# Altium schematic sheet Combinational_Logic_Functions.SchDoc
size A3
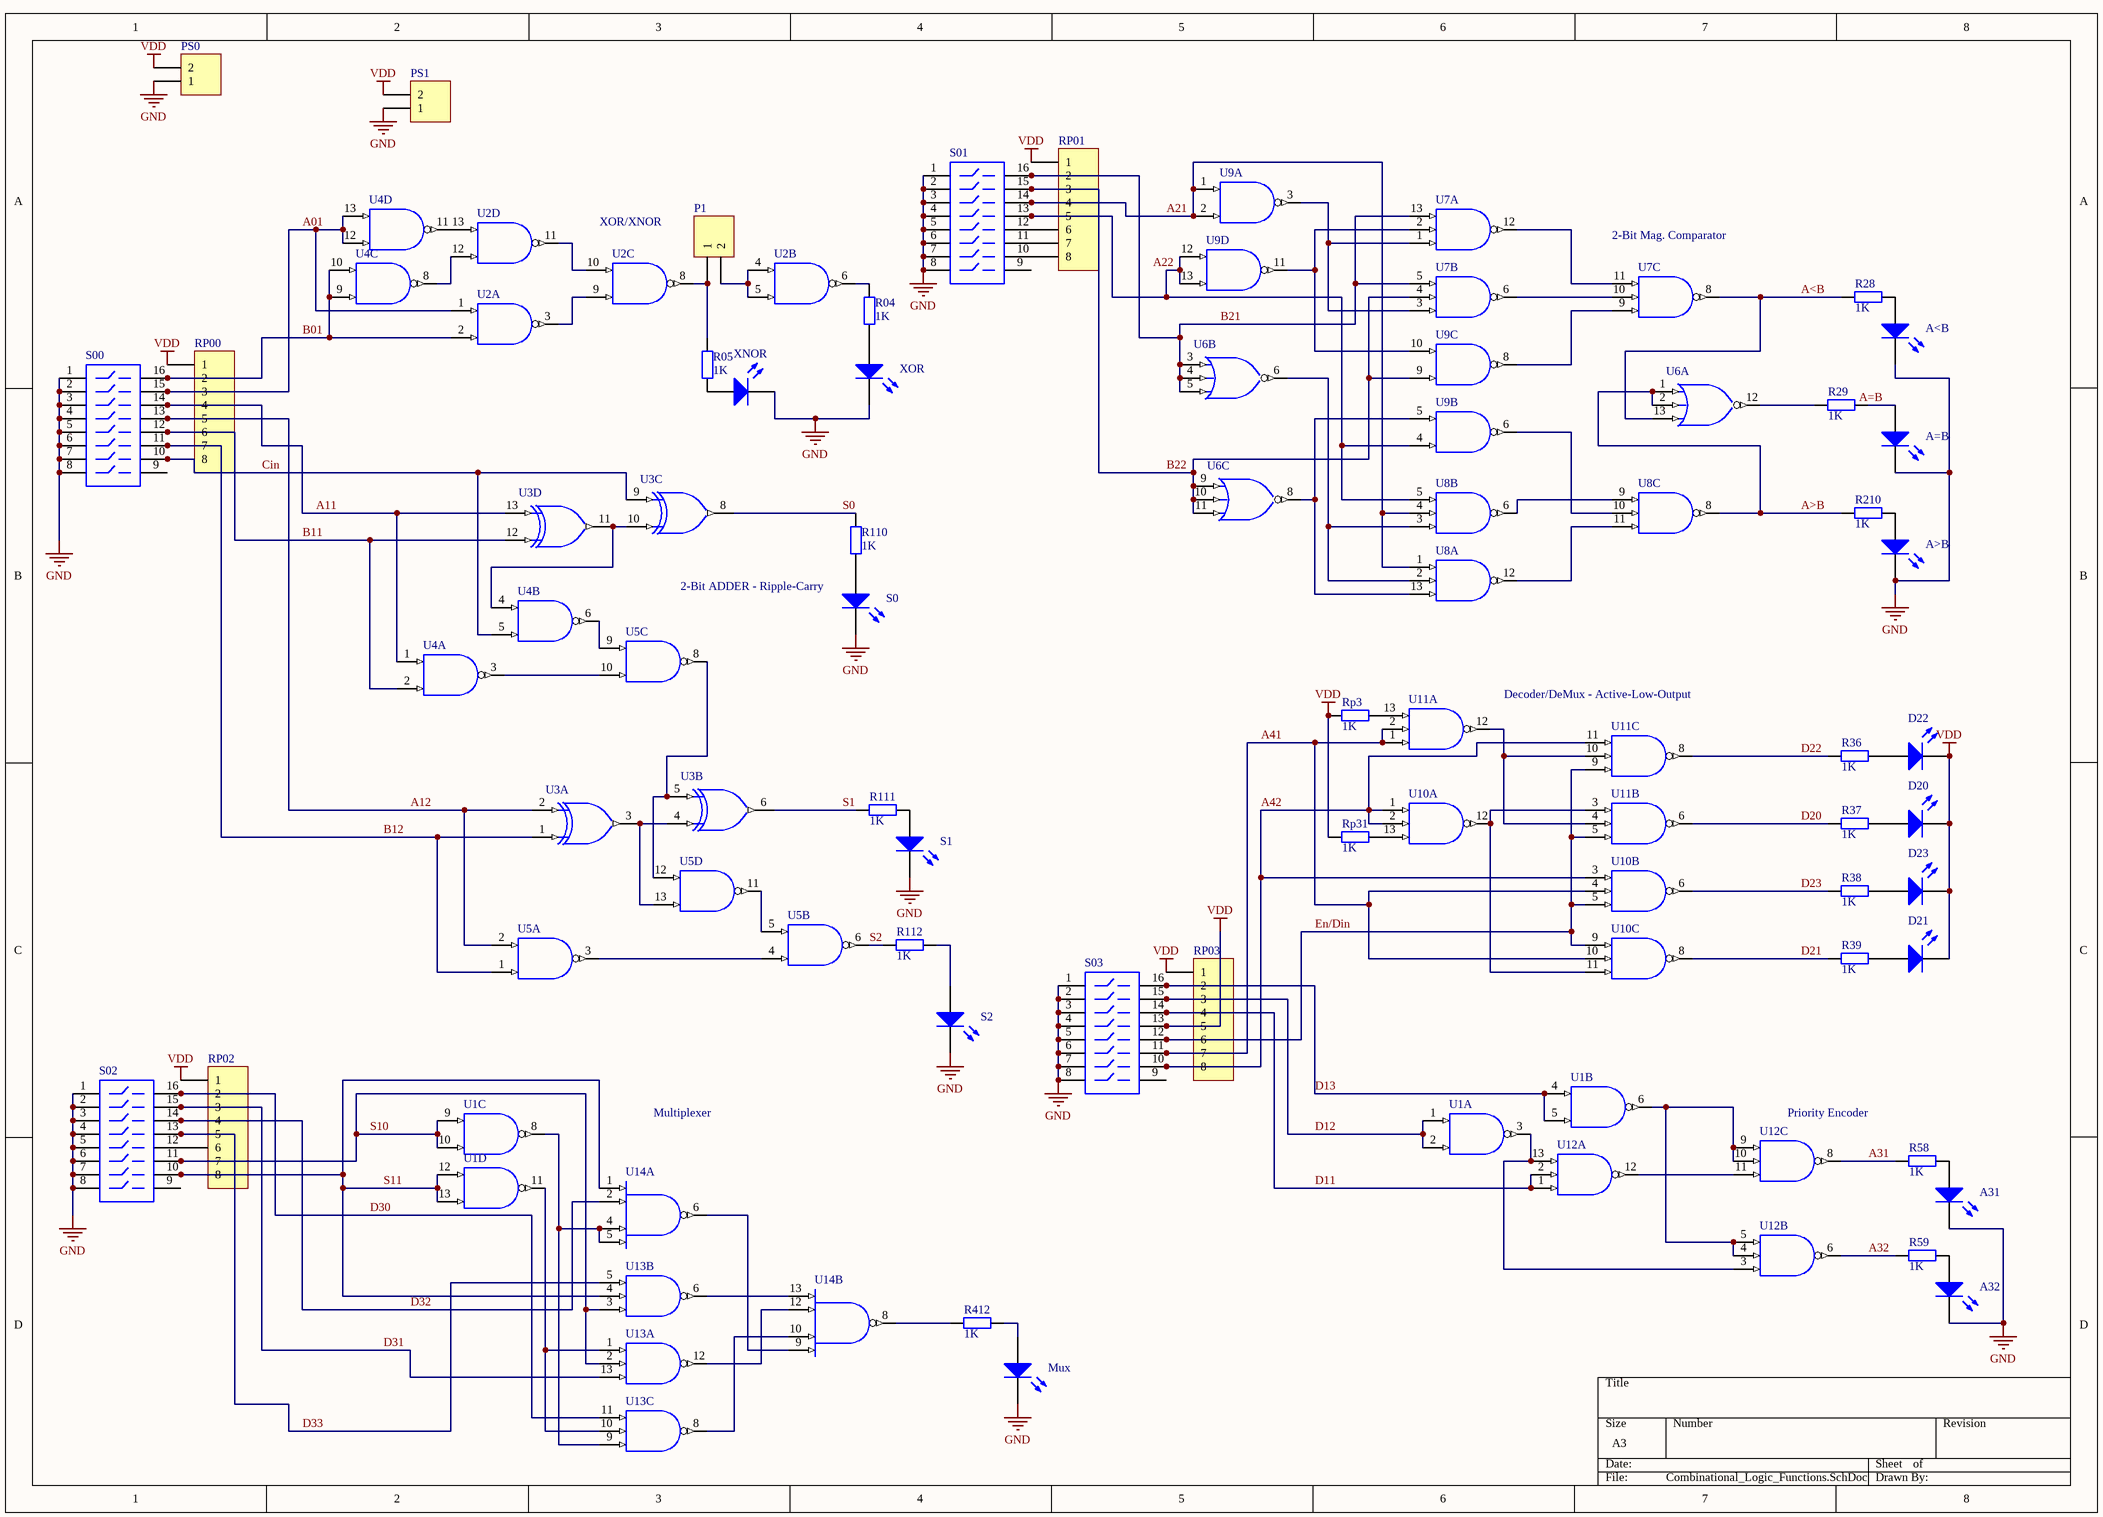
[diagram p0: Combinational_Logic_Functions.SchDoc]

## Parts
A31  LED0  [LED-0]  (value not drawn)
A32  LED0  [LED-0]  (value not drawn)
A<B  LED0  [LED-0]  (value not drawn)
A=B  LED0  [LED-0]  (value not drawn)
A>B  LED0  [LED-0]  (value not drawn)
D20  LED0  [LED-0]  (value not drawn)
D21  LED0  [LED-0]  (value not drawn)
D22  LED0  [LED-0]  (value not drawn)
D23  LED0  [LED-0]  (value not drawn)
Mux  LED0  [LED-0]  (value not drawn)
P1  Header 2  [HDR1X2]  (value not drawn)
PS0  Header 2  [HDR1X2]  (value not drawn)
PS1  Header 2  [HDR1X2]  (value not drawn)
R04  1K  [AXIAL-0.4]
R05  1K  [AXIAL-0.4]
R28  1K  [AXIAL-0.4]
R29  1K  [AXIAL-0.4]
R36  1K  [AXIAL-0.4]
R37  1K  [AXIAL-0.4]
R38  1K  [AXIAL-0.4]
R39  1K  [AXIAL-0.4]
R58  1K  [AXIAL-0.4]
R59  1K  [AXIAL-0.4]
R110  1K  [AXIAL-0.4]
R111  1K  [AXIAL-0.4]
R112  1K  [AXIAL-0.4]
R210  1K  [AXIAL-0.4]
R412  1K  [AXIAL-0.4]
RP00  Header 8  [HDR1X8]  (value not drawn)
RP01  Header 8  [HDR1X8]  (value not drawn)
RP02  Header 8  [HDR1X8]  (value not drawn)
Rp3  1K  [AXIAL-0.4]
RP03  Header 8  [HDR1X8]  (value not drawn)
Rp31  1K  [AXIAL-0.4]
S0  LED0  [LED-0]  (value not drawn)
S00  SW-DIP8  [DIP-16-KEY]  (value not drawn)
S1  LED0  [LED-0]  (value not drawn)
S01  SW-DIP8  [DIP-16-KEY]  (value not drawn)
S2  LED0  [LED-0]  (value not drawn)
S02  SW-DIP8  [DIP-16-KEY]  (value not drawn)
S03  SW-DIP8  [DIP-16-KEY]  (value not drawn)
U1  MC54HC00AJ  [632-08]  (value not drawn)  (parts A,B,C,D of 4)
U2  MC54HC00AJ  [632-08]  (value not drawn)  (parts A,B,C,D of 4)
U3  MC74HC86N  [646-06]  (value not drawn)  (parts A,B,C,D of 4)
U4  MC54HC00AJ  [632-08]  (value not drawn)  (parts A,B,C,D of 4)
U5  MC54HC00AJ  [632-08]  (value not drawn)  (parts A,B,C,D of 4)
U6  MC54HC27J  [632-08]  (value not drawn)  (parts A,B,C of 3)
U7  MC54HC10J  [632-08]  (value not drawn)  (parts A,B,C of 3)
U8  MC54HC10J  [632-08]  (value not drawn)  (parts A,B,C of 3)
U9  MC54HC00AJ  [632-08]  (value not drawn)  (parts A,B,C,D of 4)
U10  MC54HC10J  [632-08]  (value not drawn)  (parts A,B,C of 3)
U11  MC54HC10J  [632-08]  (value not drawn)  (parts A,B,C of 3)
U12  MC74HC10N  [646-06]  (value not drawn)  (parts A,B,C of 3)
U13  MC54HC10J  [632-08]  (value not drawn)  (parts A,B,C of 3)
U14  MC54HC20J  [632-08]  (value not drawn)  (parts A,B of 2)
XNOR  LED0  [LED-0]  (value not drawn)
XOR  LED0  [LED-0]  (value not drawn)

## Nets
GND: A31.2(K) A32.2(K) A<B.2(K) A=B.2(K) A>B.2(K) Mux.2(K) PS0.1 PS1.1 S00.1 S0.2(K) S00.2 S00.3 S00.4 S00.5 S00.6 S00.7 S00.8 S01.1 S1.2(K) S01.2 S01.3 S01.4 S01.5 S01.6 S01.7 S01.8 S02.1 S2.2(K) S02.2 S02.3 S02.4 S02.5 S02.6 S02.7 S02.8 S03.1 S03.2 S03.3 S03.4 S03.5 S03.6 S03.7 S03.8 U1.7(GND) U2.7(GND) U3.7(GND) U4.7(GND) U5.7(GND) U6.7(GND) U7.7(GND) U8.7(GND) U9.7(GND) U10.7(GND) U11.7(GND) U12.7(GND) U13.7(GND) U14.7(GND) XNOR.2(K) XOR.2(K)
VDD: D20.2(K) D21.2(K) D22.2(K) D23.2(K) PS0.2 PS1.2 RP00.1 RP01.1 RP02.1 Rp3.1 RP03.1 RP03.5 Rp31.1 S03.13 U1.14(VDD) U2.14(VDD) U3.14(VDD) U4.14(VDD) U5.14(VDD) U6.14(VDD) U7.14(VDD) U8.14(VDD) U9.14(VDD) U10.14(VDD) U11.14(VDD) U12.14(VDD) U13.14(VDD) U14.14(VDD)
A01: RP00.3 S00.15 U2.1(A) U4.12(A) U4.13(B)
A11: RP00.4 S00.14 U3.13(B) U4.1(A)
A12: RP00.5 S00.13 U3.2(B) U5.2(B)
A21: RP01.4 S01.14 U8.1(A) U8.4(B) U9.1(A) U9.2(B)
A31: R58.2 U12.8(Y)
A32: R59.2 U12.6(Y)
A41: RP03.7 S03.11 U10.4(B) U10.10(B) U11.1(A) U11.2(B)
A42: RP03.8 S03.10 U10.1(A) U10.2(B) U10.3(A) U11.11(C)
A<B: R28.1 U6.13(C) U7.8(Y)
A>B: R210.1 U6.1(A) U6.2(B) U8.8(Y)
B01: RP00.2 S00.16 U2.2(B) U4.9(A) U4.10(B)
B11: RP00.6 S00.12 U3.12(A) U4.2(B)
B12: RP00.7 S00.11 U3.1(A) U5.1(A)
B21: RP01.2 S01.16 U6.3(A) U6.4(B) U6.5(C) U7.5(C) U7.13(C)
B22: RP01.3 S01.15 U6.9(A) U6.10(B) U6.11(C) U7.4(B) U9.9(A)
Cin: RP00.8 S00.10 U3.9(A) U4.5(B)
D11: RP03.4 S03.14 U12.1(A) U12.2(B)
D12: RP03.3 S03.15 U1.1(A) U1.2(B)
D13: RP03.2 S03.16 U1.4(A) U1.5(B)
D20: R37.1 U11.6(Y)
D21: R39.1 U10.8(Y)
D22: R36.1 U11.8(Y)
D23: R38.1 U10.6(Y)
D30: RP02.2 S02.16 U13.11(C)
D31: RP02.3 S02.15 U13.13(C)
D32: RP02.4 S02.14 U14.2(B)
D33: RP02.5 S02.13 U13.5(C)
En/Din: RP03.6 S03.12 U10.5(C) U10.9(A) U11.5(C) U11.9(A)
S0: R110.2 U3.8(Y)
S1: R111.2 U3.6(Y)
S2: R112.2 U5.6(Y)
S10: RP02.7 S02.11 U1.9(A) U1.10(B) U13.2(B) U13.3(A)
S11: RP02.8 S02.10 U1.12(A) U1.13(B) U13.4(B) U14.1(A)
NetA31_1: A31.1(A) R58.1
NetA32_1: A32.1(A) R59.1
NetA<B_1: A<B.1(A) R28.2
NetA=B_1: A=B.1(A) R29.2
NetA>B_1: A>B.1(A) R210.2
NetD20_1: D20.1(A) R37.2
NetD21_1: D21.1(A) R39.2
NetD22_1: D22.1(A) R36.2
NetD23_1: D23.1(A) R38.2
NetMux_1: Mux.1(A) R412.1
NetP1_1: P1.1 R05.2 U2.8(Y)
NetP1_2: P1.2 U2.4(A) U2.5(B)
NetR04_1: R04.1 XOR.1(A)
NetR04_2: R04.2 U2.6(Y)
NetR05_1: R05.1 XNOR.1(A)
NetR29_1: R29.1 U6.12(Y)
NetR110_1: R110.1 S0.1(A)
NetR111_1: R111.1 S1.1(A)
NetR112_1: R112.1 S2.1(A)
NetR412_2: R412.2 U14.8(Y)
NetRP01_5: RP01.5 S01.13 U8.5(C) U9.4(A) U9.12(A) U9.13(B)
NetRP01_6: RP01.6 S01.12
NetRP01_7: RP01.7 S01.11
NetRP01_8: RP01.8 S01.10
NetRP02_6: RP02.6 S02.12
NetRp3_2: Rp3.2 U11.13(C)
NetRp31_2: Rp31.2 U10.13(C)
NetU1_3: U1.3(Y) U12.3(A) U12.13(C)
NetU1_6: U1.6(Y) U12.4(B) U12.5(C) U12.9(A) U12.10(B)
NetU1_8: U1.8(Y) U13.9(A) U14.4(C) U14.5(D)
NetU1_11: U1.11(Y) U13.1(A) U13.10(B)
NetU2_3: U2.3(Y) U2.9(A)
NetU2_10: U2.10(B) U2.11(Y)
NetU2_12: U2.12(A) U4.8(Y)
NetU2_13: U2.13(B) U4.11(Y)
NetU3_3: U3.3(Y) U3.4(A) U5.13(B)
NetU3_5: U3.5(B) U5.8(Y) U5.12(A)
NetU3_10: U3.10(B) U3.11(Y) U4.4(A)
NetU4_3: U4.3(Y) U5.10(B)
NetU4_6: U4.6(Y) U5.9(A)
NetU5_3: U5.3(Y) U5.4(A)
NetU5_5: U5.5(B) U5.11(Y)
NetU6_6: U6.6(Y) U8.2(B) U8.3(A)
NetU6_8: U6.8(Y) U8.13(C) U9.5(B)
NetU7_1: U7.1(A) U7.3(A) U9.3(Y)
NetU7_2: U7.2(B) U9.10(B) U9.11(Y)
NetU7_6: U7.6(Y) U7.10(B)
NetU7_9: U7.9(A) U9.8(Y)
NetU7_11: U7.11(C) U7.12(Y)
NetU8_6: U8.6(Y) U8.9(A)
NetU8_10: U8.10(B) U9.6(Y)
NetU8_11: U8.11(C) U8.12(Y)
NetU10_11: U10.11(C) U10.12(Y) U11.3(A)
NetU11_4: U11.4(B) U11.10(B) U11.12(Y)
NetU12_11: U12.11(C) U12.12(Y)
NetU13_6: U13.6(Y) U14.13(D)
NetU13_8: U13.8(Y) U14.10(B)
NetU13_12: U13.12(Y) U14.12(C)
NetU14_6: U14.6(Y) U14.9(A)

Not connected (* = marked no-connect by the designer): S00 9; S01 9; S02 9; S03 9

## Notes on the sheet
- (near U2) XOR/XNOR
- (near U7) 2-Bit Mag. Comparator
- (near S0) 2-Bit ADDER - Ripple-Carry
- (near U11) Decoder/DeMux - Active-Low-Output
- Multiplexer
- (near U12) Priority Encoder
- Labels drawn without touching a wire or pin: A22, A=B

## Library data of the parts
A31 A32 A<B A=B A>B D20-D23 Mux S0-S2 XNOR XOR = LED0: Typical INFRARED GaAs LED; Published: 8-Jun-2000; LatestRevisionDate: 08-Jul-2005; LatestRevisionNote: Mech Layer 1 removed.; PackageReference: LED-0; Publisher: Altium Limited; PackageDescription: LED; 2 Leads
P1 PS0 PS1 = Header 2: Header, 2-Pin; LatestRevisionDate: 17-Jul-2002; LatestRevisionNote: Re-released for DXP Platform.; Publisher: Altium Limited
R04 R05 R28 R29 R36-R39 R58 R59 R110-R112 R210 R412 Rp3 Rp31 = Res2: Resistor; Published: 8-Jun-2000; LatestRevisionDate: 17-Jul-2002; LatestRevisionNote: Re-released for DXP Platform.; PackageReference: AXIAL-0.4; Publisher: Altium Limited; PackageDescription: Axial Device, Thru-Hole; 2 Leads; 0.4 in Pin Spacing; Value: 1K
RP00 RP01 RP02 RP03 = Header 8: Header, 8-Pin; LatestRevisionDate: 17-Jul-2002; LatestRevisionNote: Re-released for DXP Platform.; Publisher: Altium Limited
S00 S01 S02 S03 = SW-DIP8: 4009 Series DIP Switch, Raised actuator; Published: 24-Mar-1999; LatestRevisionDate: 17-Dec-2003; LatestRevisionNote: PCB Footprint replaced.; PackageReference: DIP-16-KEY; Publisher: Altium Limited; PackageDescription: DIP; 16 Leads; Row Spacing 7.62 mm; Pitch 2.54 mm; ComponentLink1Description: Manufacturer Link; ComponentLink1URL: http://www.oupiin.com/prodindx.html#Headers
U1 U2 U4 U5 U9 = MC54HC00AJ: Quad 2-Input NAND Gate; Published: 17-Jul-2002; LatestRevisionDate: 06-Jun-2005; LatestRevisionNote: Stylized 3D Model Added; DatasheetVersion: 1989; PackageReference: 632-08; Publisher: Altium Limited; PackageDescription: DIP; 14 Leads; Row Spacing 7.62 mm; Pitch 2.54 mm; ComponentLink1Description: Manufacturer Link; ComponentLink1URL: http://www.onsemi.com/site/products/parametrics/0,4446,247,00.html; ComponentLink2Description: Ibis Model; ComponentLink2URL: http://www.onsemi.com/pub/Collateral/MC54HC00AJ.IBS
U3 = MC74HC86N: Quad 2-Input XOR Gate; Published: 17-Jul-2002; LatestRevisionDate: 06-Jun-2005; LatestRevisionNote: Stylized 3D Model Added; DatasheetVersion: 1989; PackageVersion: 1997; PackageReference: 646-06; Publisher: Altium Limited; PackageDescription: DIP; 14 Leads; Row Spacing 7.62 mm; Pitch 2.54 mm; ComponentLink1Description: Manufacturer Link; ComponentLink1URL: http://www.onsemi.com/site/products/parametrics/0,4446,247,00.html; ComponentLink2Description: Ibis Model; ComponentLink2URL: http://www.onsemi.com/pub/Collateral/MC54HC86J.IBS
U6 = MC54HC27J: Triple 3-Input NOR Gate; Published: 17-Jul-2002; LatestRevisionDate: 06-Jun-2005; LatestRevisionNote: Stylized 3D Model Added; DatasheetVersion: 1989; PackageReference: 632-08; Publisher: Altium Limited; PackageDescription: DIP; 14 Leads; Row Spacing 7.62 mm; Pitch 2.54 mm; ComponentLink1Description: Manufacturer Link; ComponentLink1URL: http://www.onsemi.com/site/products/parametrics/0,4446,247,00.html; ComponentLink2Description: Ibis Model; ComponentLink2URL: http://www.onsemi.com/pub/Collateral/MC54HC27J.IBS
U7 U8 U10 U11 U13 = MC54HC10J: Triple 3-Input NAND Gate; Published: 17-Jul-2002; LatestRevisionDate: 06-Jun-2005; LatestRevisionNote: Stylized 3D Model Added; DatasheetVersion: 1989; PackageReference: 632-08; Publisher: Altium Limited; PackageDescription: DIP; 14 Leads; Row Spacing 7.62 mm; Pitch 2.54 mm; ComponentLink1Description: Manufacturer Link; ComponentLink1URL: http://www.onsemi.com/site/products/parametrics/0,4446,247,00.html; ComponentLink2Description: Ibis Model; ComponentLink2URL: http://www.onsemi.com/pub/Collateral/MC54HC10J.IBS
U12 = MC74HC10N: Triple 3-Input NAND Gate; Published: 17-Jul-2002; LatestRevisionDate: 06-Jun-2005; LatestRevisionNote: Stylized 3D Model Added; DatasheetVersion: 1989; PackageVersion: 1997; PackageReference: 646-06; Publisher: Altium Limited; PackageDescription: DIP; 14 Leads; Row Spacing 7.62 mm; Pitch 2.54 mm; ComponentLink1Description: Manufacturer Link; ComponentLink1URL: http://www.onsemi.com/site/products/parametrics/0,4446,247,00.html; ComponentLink2Description: Ibis Model; ComponentLink2URL: http://www.onsemi.com/pub/Collateral/MC54HC10J.IBS
U14 = MC54HC20J: Dual 4-Input NAND Gate; Note: Pins 3,11 are Not Connected and not drawn.; Published: 17-Jul-2002; LatestRevisionDate: 06-Jun-2005; LatestRevisionNote: Stylized 3D Model Added; DatasheetVersion: 1989; PackageReference: 632-08; Publisher: Altium Limited; PackageDescription: DIP; 14 Leads; Row Spacing 7.62 mm; Pitch 2.54 mm; ComponentLink1Description: Manufacturer Link; ComponentLink1URL: http://www.onsemi.com/site/products/parametrics/0,4446,247,00.html; ComponentLink2Description: Ibis Model; ComponentLink2URL: http://www.onsemi.com/pub/Collateral/MC54HC20J.IBS